# Altium schematic sheet mach-relay.SchDoc
size OrCAD A
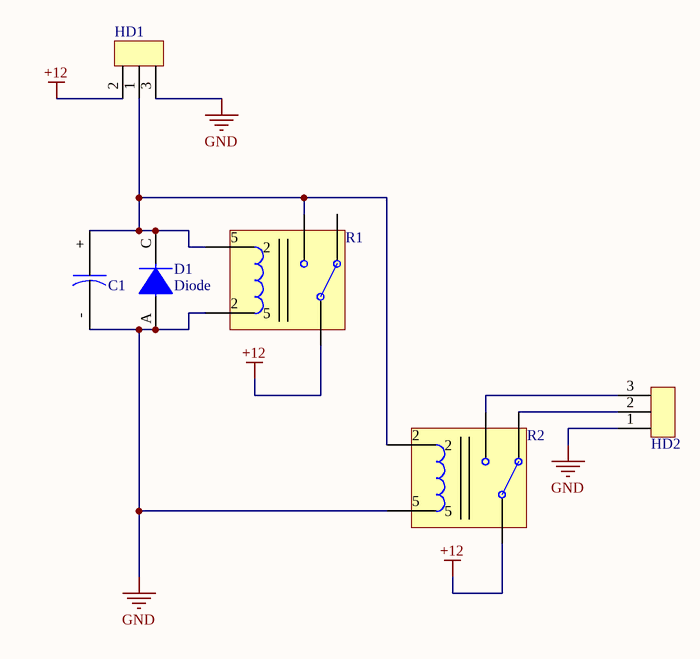
[diagram p0: mach-relay.SchDoc]

## Parts
C1  Pol-Cap  [POL_250mil]  (value not drawn)
D1  Diode  [DIODE - VERTICAL]
HD1  HD_3  [HEADER_3]  (value not drawn)
HD2  HD_3  [HEADER_3]  (value not drawn)
R1  Relay_5pin  [RELAY-5PIN]  (value not drawn)
R2  Relay_5pin  [RELAY-5PIN]  (value not drawn)

## Nets
+12: HD1.2 R1.1 R2.1
GND: C1.- D1.A HD1.3 HD2.1 R1.2(5) R2.5
NetC1_+: C1.+ D1.C HD1.1 R1.3 R1.5(2) R2.2
NetHD2_2: HD2.2 R2.4
NetHD2_3: HD2.3 R2.3

Not connected (* = marked no-connect by the designer): R1 4

## Notes on the sheet
- Title
- Size:
- Date:
- Orcad A
- Number:
- Time:
- Revision:
- Sheet
- of
- File:

## Library data of the parts
C1 = Pol-Cap: Tụ điện phân cực